# Altium schematic sheet GSM Signal Control.SchDoc: GSM Control Signal Management
size A4; SheetNumber: 27; SheetTotal: 37
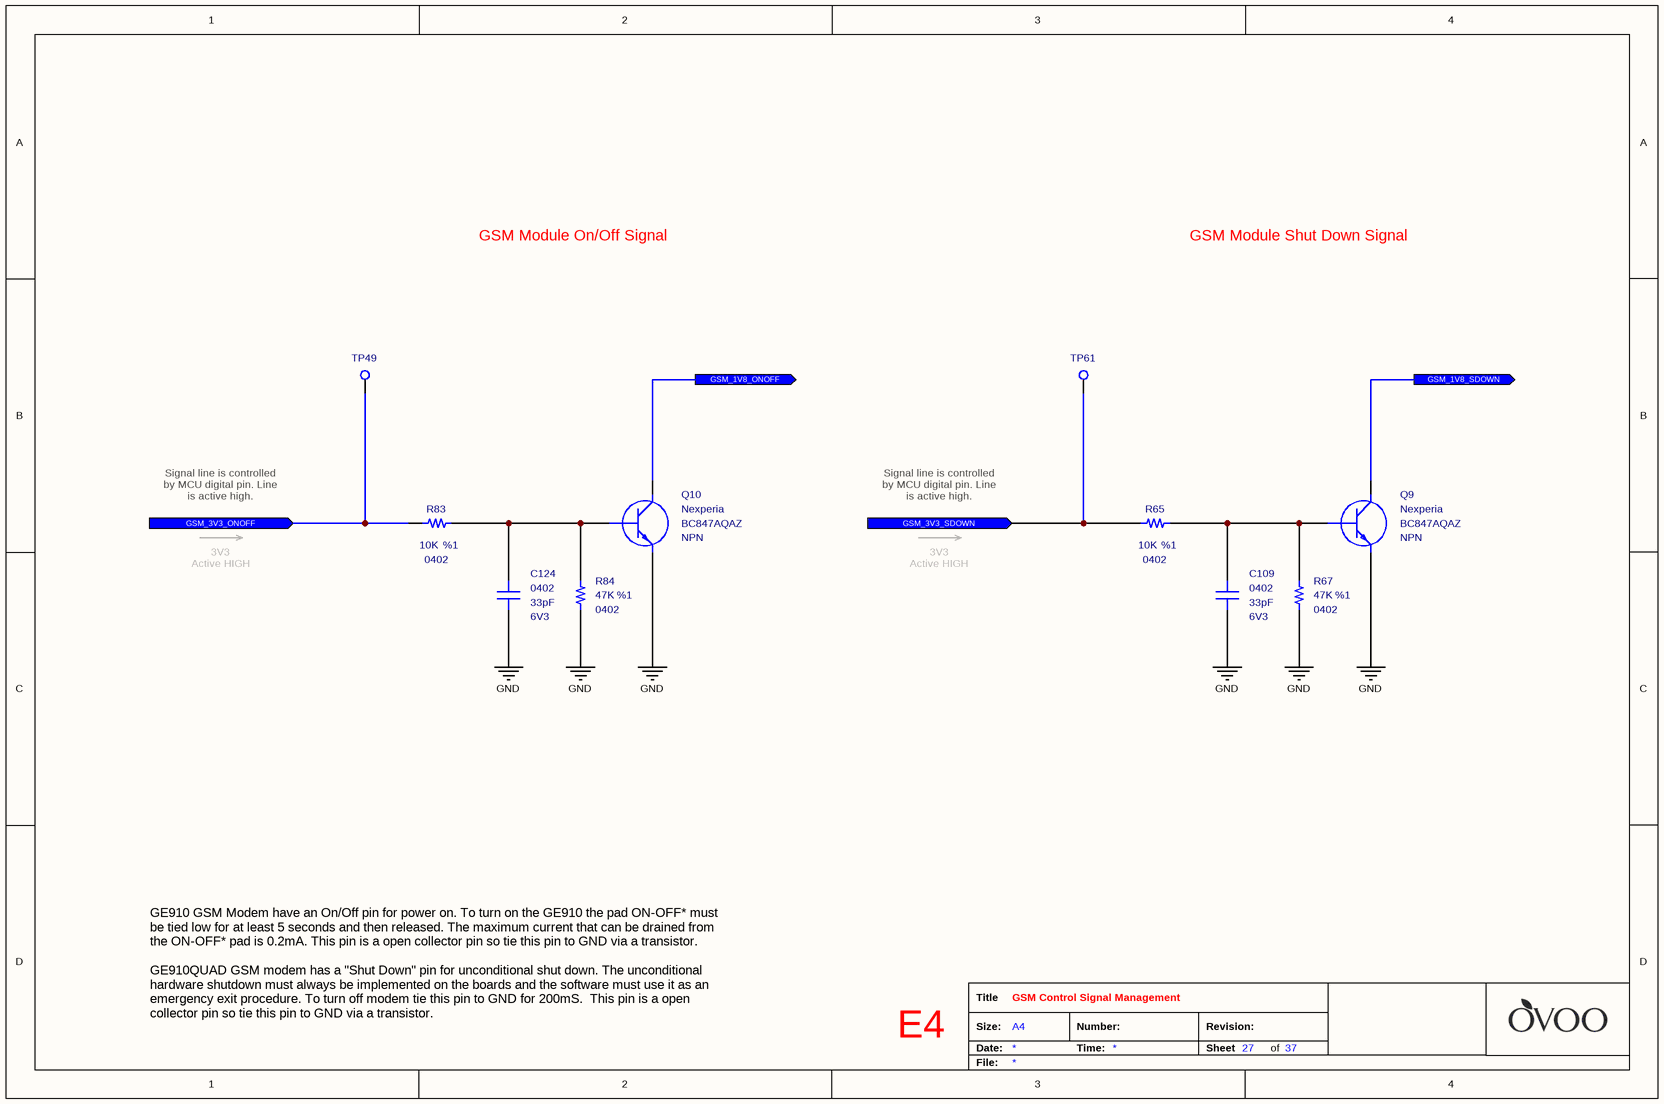
[diagram p0: GSM Signal Control.SchDoc]

## Parts
C109  value 33pF  Case: 0402  Voltage: 6V3  [CAPACITOR_0402]  (hidden comment: Multilayer Ceramic Capacitor)
C124  value 33pF  Case: 0402  Voltage: 6V3  [CAPACITOR_0402]  (hidden comment: Multilayer Ceramic Capacitor)
Q9  Manufacturer_Name: Nexperia  Manufacturer_Part_Number: BC847AQAZ  Polarity: NPN  [SOT1215]  (hidden comment: Bipolar NPN Transistors)
Q10  Manufacturer_Name: Nexperia  Manufacturer_Part_Number: BC847AQAZ  Polarity: NPN  [SOT1215]  (hidden comment: Bipolar NPN Transistors)
R65  value 10K  Tolerance: %1  Case: 0402  [RESISTOR_0402]  (hidden comment: Thick Film Resistor)
R67  value 47K  Tolerance: %1  Case: 0402  [RESISTOR_0402]  (hidden comment: Thick Film Resistor)
R83  value 10K  Tolerance: %1  Case: 0402  [RESISTOR_0402]  (hidden comment: Thick Film Resistor)
R84  value 47K  Tolerance: %1  Case: 0402  [RESISTOR_0402]  (hidden comment: Thick Film Resistor)
TP49  PCB - Test Point  [Test_Pad - Hole]  (value not drawn)  (no BOM)
TP61  PCB - Test Point  [Test_Pad - Hole]  (value not drawn)  (no BOM)

## Ports
GSM_1V8_ONOFF (out), GSM_1V8_SDOWN (out), GSM_3V3_ONOFF (in), GSM_3V3_SDOWN (in)

## Nets
GND: C109.2 C124.2 Q9.2(E) Q10.2(E) R67.1 R84.1
GSM_1V8_ONOFF: Q10.3(C) ; port GSM_1V8_ONOFF
GSM_1V8_SDOWN: Q9.3(C) ; port GSM_1V8_SDOWN
GSM_3V3_ONOFF: R83.2 TP49.1 ; port GSM_3V3_ONOFF
GSM_3V3_SDOWN: R65.2 TP61.1 ; port GSM_3V3_SDOWN
NetC109_1: C109.1 Q9.1(B) R65.1 R67.2
NetC124_1: C124.1 Q10.1(B) R83.1 R84.2

## Notes on the sheet
- GSM Module On/Off Signal
- GSM Module Shut Down Signal
- Signal line is controlled by MCU digital pin. Line is active high.
- 3V3
  Active HIGH
- GE910 GSM Modem have an On/Off pin for power on. To turn on the GE910 the pad ON-OFF* must be tied low for at least 5 seconds and then released. The maximum current that can be drained from the ON-OFF* pad is 0.2mA. This pin is a open collector pin so tie this pin to GND via a transistor.
  GE910QUAD GSM modem has a "Shut Down" pin for unconditional shut down. The unconditional hardware shutdown must always be implemented on the boards and the software must use it as an emergency exit procedure. To turn off modem tie this pin to GND for 200mS.  This pin is a open collector pin so tie this pin to GND via a transistor.
- E4
- Title
- Size:
- Date:
- A4
- Number:
- Time:
- Revision:
- Sheet
- of
- File:

## Library data of the parts
C109 C124 = Capacitor - 33pF [0402-6V3]: Capacitor - 33pF [0402] (Ceramic); Manufacturer_Name: Kemet; Manufacturer_Part_Number: C0402C330J9RACAUTO; Dielectric: X7R; Tolerance: 10%; Height: 0.5mm; Mouser_Part_Number: 80-C0402C330J9RAUTO; Maximum Operating Temperature: +125; Minimum Operating Temperature: -55; ROHS: Yes; ComponentLink1Description: DataSheet; ComponentLink1URL: https://api.kemet.com/component-edge/download/datasheet/C0402C330J9RACAUTO.pdf; ComponentLink2Description: Mouser; ComponentLink2URL: https://www.mouser.com/Search/Refine.aspx?Keyword=80-C0402C330J9RAUTO; Supplier 1: Mouser; Supplier Part Number 1: 80-C0402C330J9RAUTO
Q9 Q10 = Transistor - BC847: Bipolar Transistors - BJT BC847AQA/DFN1010D-3/REEL 7" Q2; Mouser_Part_Number: 771-BC847AQAZ; ComponentLink1Description: DataSheet; ComponentLink1URL: https://www.mouser.com.tr/datasheet/2/916/BC847XQA_SER-1598405.pdf; ComponentLink2Description: Mouser; ComponentLink2URL: https://www.mouser.com.tr/ProductDetail/Nexperia/BC847AQAZ?qs=%2Fha2pyFaduhKMCPKNtQimeJpXTw9z4AqURd2YARs8DVICZNv3AT9Dw%3D%3D; Case: DFN-1010D-3; Supplier 1: Mouser; Supplier 2: Digi-Key; Supplier Part Number 1: 771-BC847AQAZ; Supplier Part Number 2: 1727-2545-1-ND
R65 R83 = Resistor - 10K: Thick Film Resistors - SMD 1/16 W 10 Kohms 1%; Manufacturer_Name: Vishay; Manufacturer_Part_Number: CRCW040210K0FKED; Height: 0.4mm; Mouser_Part_Number: 71-CRCW0402-10K-E3; ComponentLink1Description: DataSheet; ComponentLink1URL: https://www.mouser.com.tr/datasheet/2/427/dcrcwe3-1762152.pdf; ComponentLink2Description: Mouser; ComponentLink2URL: https://www.mouser.com.tr/ProductDetail/Vishay-Dale/CRCW040210K0FKED?qs=sGAEpiMZZMu61qfTUdNhG2DpbjADlD3GcalbOv9utCY%3D; Supplier 1: Mouser; Supplier 2: Digi-Key; Supplier Part Number 1: 71-CRCW040210K0FKEDH; Supplier Part Number 2: 541-10.0KYCT-ND
R67 R84 = Resistor - 47K: Thick Film Resistors - SMD 1/16 W 47 Kohms 1%; Manufacturer_Name: Vishay; Manufacturer_Part_Number: CRCW040247K0FKED; Height: 0.4mm; Mouser_Part_Number: 71-CRCW0402-47K-E3; ComponentLink1Description: DataSheet; ComponentLink1URL: https://www.mouser.com.tr/datasheet/2/427/dcrcwe3-1762152.pdf; ComponentLink2Description: Mouser; ComponentLink2URL: https://www.mouser.com.tr/ProductDetail/Vishay-Dale/CRCW040247K0FKED?qs=sGAEpiMZZMu61qfTUdNhG2DpbjADlD3GL%252B3h1elTxqU%3D; Supplier 1: Mouser; Supplier 2: Digi-Key; Supplier Part Number 1: 71-CRCW040247K0FKEDH; Supplier Part Number 2: 541-47.0KYCT-ND
TP49 TP61 = PCB - Test Point: Test Point